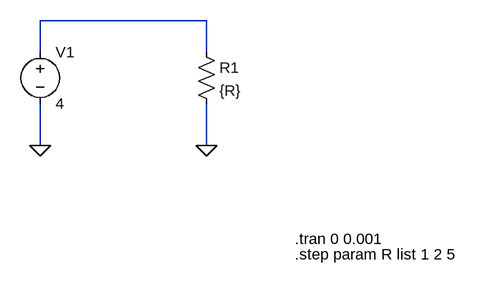
[diagram p0: schematic simple_resistor_stepped.asc]
simple_resistor_stepped.asc, the LTspice schematic file:
Version 4
SHEET 1 904 680
WIRE 512 192 256 192
WIRE 256 240 256 192
WIRE 512 240 512 192
WIRE 256 384 256 320
WIRE 512 384 512 320
FLAG 256 384 0
FLAG 512 384 0
SYMBOL voltage 256 224 R0
SYMATTR InstName V1
SYMATTR Value 4
SYMBOL res 496 224 R0
SYMATTR InstName R1
SYMATTR Value {R}
TEXT 648 528 Left 2 !.tran 0 0.001
TEXT 648 552 Left 2 !.step param R list 1 2 5

The netlist it stands for:
* simple_resistor_stepped.asc
V1 N001 0 4
R1 N001 0 {R}
.tran 0 0.001
.step param R list 1 2 5
.backanno
.end